# EasyEDA Pro project ProPrj_Hitboard PCB Lite v1.6 typec 左上_2026-01-22.epro

# Board PCB1
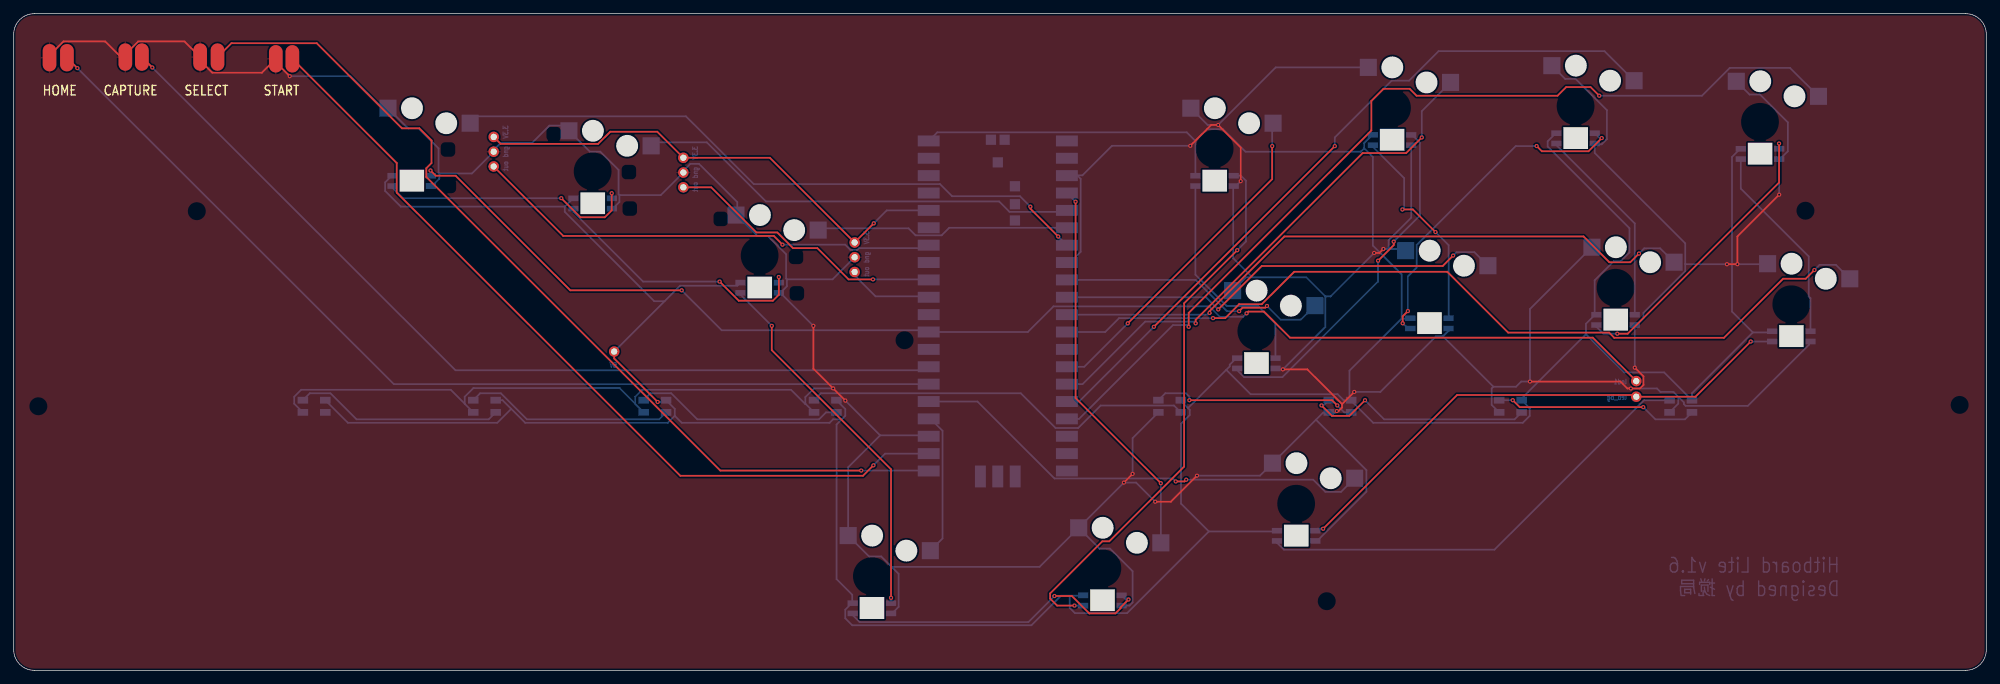
[diagram p0: board, top side]
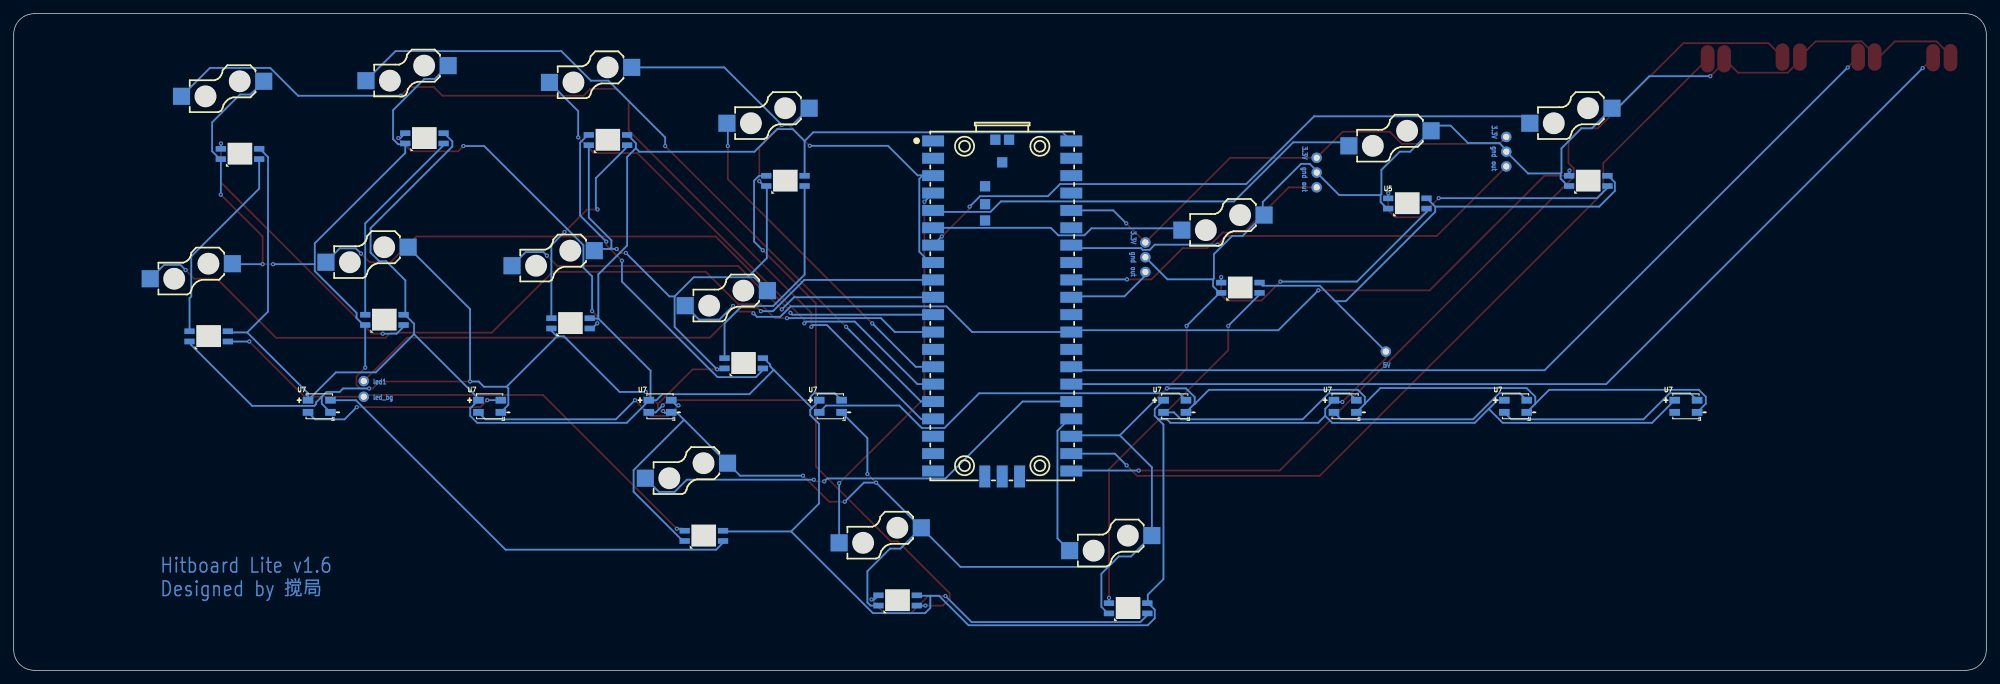
[diagram p1: board, bottom side, seen from below]

Outline 288 x 96 mm; copper layers: Top Layer, Bottom Layer. Coordinates in mm from the lower left corner of the outline.
Outline path: 0,93 arc(0.88,95.12) 3,96 285,96 arc(287.12,95.12) 288,93 288,3 arc(287.12,0.88) 285,0 3,0 arc(0.88,0.88) 0,3 0,93
Stack: Top Layer 0.035mm / Dielectric1 1.51mm FR4 er 4.5 / Bottom Layer 0.035mm

## Design rules (mm)
template: JLCPCB Capability(Two Layers Board)
spacing copperThickness1oz (default): track to track 0.102, other pairs 0.152 to 0.3
spacing copperThickness2oz: track to track 0.203, other pairs 0.152 to 0.3
track width copperThickness1oz (default): min 0.127, default 0.254, max 2.54
track width copperThickness2oz: min 0.203, default 0.254, max 2.54
differential pair differentialPair (default): width min 0.127, default 0.254, max 2.54; gap min 0.152, default 0.152
via viaSize (default): diameter min 0.5, default 0.61, max 10; hole min 0.3, default 0.305, max 6.3

## Placement (name value [footprint] x y rotation side)
NOREF  -  [Pad_e10670]  70.08 77.98 90 top
NOREF#2  -  [Pad_e679]  27.22 89.66 0 top
NOREF#3  -  [Pad_e682]  40.68 89.4 0 top
NOREF#4  -  [Pad_e680]  29.76 89.66 0 top
NOREF#5  -  [Pad_e10672]  70.08 73.66 90 top
NOREF#6  -  [Pad_e676]  7.77 89.56 0 top
NOREF#7  -  [Pad_e681]  38.27 89.4 0 top
NOREF#8  -  [Pad_e10657]  122.78 60.39 90 top
NOREF#9  -  [Pad_e10666]  97.77 70.62 90 top
NOREF#10  -  [Pad_e10665]  97.77 72.78 90 top
NOREF#11  -  [Pad_e434]  236.9 42.29 0 top
NOREF#12  -  [Pad_e10658]  122.78 58.23 90 top
NOREF#13  -  [Pad_e10654]  87.67 46.6 0 top
NOREF#14  -  [Pad_e678]  18.71 89.66 0 top
NOREF#15  -  [Pad_e675]  5.23 89.56 0 top
NOREF#16  -  [Pad_e5255]  236.9 40 0 top
NOREF#17  -  [Pad_e10664]  97.77 74.93 90 top
NOREF#18  -  [Pad_e677]  16.3 89.66 0 top
NOREF#19  -  [Pad_e10671]  70.08 75.82 90 top
NOREF#20  -  [Pad_e10656]  122.78 62.55 90 top
U1  PICO  [COMM-SMD_L51.0-W21.0-P2.54_SC0916]  143.68 52.95 270 bottom
U5  -  [LED-SMD_L3.2-W2.8_YO-WS2812B-3528]  187.24 19.66 180 bottom
U5#2  -  [LED-SMD_L3.2-W2.8_YO-WS2812B-3528]  58.11 71.56 180 bottom
U5#3  -  [LED-SMD_L3.2-W2.8_YO-WS2812B-3528]  84.52 68.25 180 bottom
U5#4  -  [LED-SMD_L3.2-W2.8_YO-WS2812B-3528]  108.91 55.93 180 bottom
U5#5  -  [LED-SMD_L3.2-W2.8_YO-WS2812B-3528]  125.29 9.07 180 bottom
U5#6  -  [LED-SMD_L3.2-W2.8_YO-WS2812B-3528]  158.95 10.21 180 bottom
U5#7  -  [LED-SMD_L3.2-W2.8_YO-WS2812B-3528]  175.33 71.56 180 bottom
U5#8  -  [LED-SMD_L3.2-W2.8_YO-WS2812B-3528]  181.43 44.89 180 bottom
U5#9  -  [LED-SMD_L3.2-W2.8_YO-WS2812B-3528]  201.24 77.52 180 bottom
U5#10  -  [LED-SMD_L3.2-W2.8_YO-WS2812B-3528]  206.7 50.73 180 bottom
U5#11  -  [LED-SMD_L3.2-W2.8_YO-WS2812B-3528]  228.03 77.78 180 bottom
U5#12  -  [LED-SMD_L3.2-W2.8_YO-WS2812B-3528]  233.88 51.24 180 bottom
U5#13  -  [LED-SMD_L3.2-W2.8_YO-WS2812B-3528]  254.96 75.49 180 bottom
U5#14  -  [LED-SMD_L3.2-W2.8_YO-WS2812B-3528]  259.53 48.82 180 bottom
U6  -  [CONN-SMD_HOTPLUGPAKAGE__C9900010116-1]  189.78 29.18 180 bottom
U6#2  -  [CONN-SMD_HOTPLUGPAKAGE__C9900010116-1]  60.65 81.08 180 bottom
U6#3  -  [CONN-SMD_HOTPLUGPAKAGE__C9900010116-1]  87.06 77.78 180 bottom
U6#4  -  [CONN-SMD_HOTPLUGPAKAGE__C9900010116-1]  111.45 65.46 180 bottom
U6#5  -  [CONN-SMD_HOTPLUGPAKAGE__C9900010116-1]  127.83 18.6 180 bottom
U6#6  -  [CONN-SMD_HOTPLUGPAKAGE__C9900010116-1]  161.49 19.74 180 bottom
U6#7  -  [CONN-SMD_HOTPLUGPAKAGE__C9900010116-1]  177.87 81.08 180 bottom
U6#8  -  [CONN-SMD_HOTPLUGPAKAGE__C9900010116-1]  183.97 54.41 180 bottom
U6#9  -  [CONN-SMD_HOTPLUGPAKAGE__C9900010116-1]  203.78 87.05 180 bottom
U6#10  -  [CONN-SMD_HOTPLUGPAKAGE__C9900010116-1]  209.24 60.25 180 bottom
U6#11  -  [CONN-SMD_HOTPLUGPAKAGE__C9900010116-1]  230.57 87.3 180 bottom
U6#12  -  [CONN-SMD_HOTPLUGPAKAGE__C9900010116-1]  236.42 60.76 180 bottom
U6#13  -  [CONN-SMD_HOTPLUGPAKAGE__C9900010116-1]  257.5 85.02 180 bottom
U6#14  -  [CONN-SMD_HOTPLUGPAKAGE__C9900010116-1]  262.07 58.35 180 bottom
U7  -  [LED-SMD_4P-L3.5-W3.5-TL_WS2812B]  243.39 38.6 180 bottom
U7#2  -  [LED-SMD_4P-L3.5-W3.5-TL_WS2812B]  218.51 38.6 180 bottom
U7#3  -  [LED-SMD_4P-L3.5-W3.5-TL_WS2812B]  193.64 38.6 180 bottom
U7#4  -  [LED-SMD_4P-L3.5-W3.5-TL_WS2812B]  168.76 38.6 180 bottom
U7#5  -  [LED-SMD_4P-L3.5-W3.5-TL_WS2812B]  118.48 38.6 180 bottom
U7#6  -  [LED-SMD_4P-L3.5-W3.5-TL_WS2812B]  93.61 38.6 180 bottom
U7#7  -  [LED-SMD_4P-L3.5-W3.5-TL_WS2812B]  68.73 38.6 180 bottom
U7#8  -  [LED-SMD_4P-L3.5-W3.5-TL_WS2812B]  43.86 38.6 180 bottom

## Footprints (pads in the part's own frame, mm; a bottom-side part is the same pattern mirrored in y, then rotated)
COMM-SMD_L51.0-W21.0-P2.54_SC0916
  rect 1.6x3.2 smd: 1(-24.445,-10.088) 2(-21.905,-10.088) 3(-19.365,-10.088) 4(-16.825,-10.088) 5(-14.285,-10.088) 6(-11.745,-10.088) 7(-9.205,-10.088) 8(-6.665,-10.088) 9(-4.125,-10.088) 10(-1.585,-10.088) 11(0.955,-10.088) 12(3.495,-10.088) 13(6.035,-10.088) 14(8.575,-10.088) 15(11.115,-10.088) 16(13.655,-10.088) 17(16.195,-10.088) 18(18.735,-10.088) 19(21.275,-10.088) 20(23.815,-10.088) 21(23.815,10.088) 22(21.275,10.088) 23(18.735,10.088) 24(16.195,10.088) 25(13.655,10.088) 26(11.115,10.088) 27(8.575,10.088) 28(6.035,10.088) 29(3.495,10.088) 30(0.955,10.088) 31(-1.585,10.088) 32(-4.125,10.088) 33(-6.665,10.088) 34(-9.205,10.088) 35(-11.745,10.088) 36(-14.285,10.088) 37(-16.825,10.088) 38(-19.365,10.088) 39(-21.905,10.088) 40(-24.445,10.088)
  rect 3.2x1.6 smd: 41(24.615,-2.54) 42(24.615,0) 43(24.615,2.54)
  rect 1.5x1.5 smd: TP1(-21.315,0) TP2(-24.615,1) TP3(-24.615,-1) TP4(-17.815,-2.5) TP5(-15.188,-2.5) TP6(-12.815,-2.5)
CONN-SMD_HOTPLUGPAKAGE__C9900010116-1
  rect 2.5x2.5 smd: 1(-6,-1.1) 2(6,1.1)
LED-SMD_4P-L3.5-W3.5-TL_WS2812B
  rect 1.545x0.997 smd: 1(-1.637,0.89) 2(-1.637,-0.89) 3(1.637,-0.89) 4(1.637,0.89)
LED-SMD_L3.2-W2.8_YO-WS2812B-3528
  rect 1.5x0.82 smd: 1(2.8,0.75) 2(2.8,-0.75) 3(-2.8,-0.75) 4(-2.8,0.75)
Pad_e434
  round 1.524 hole 0.914: 1(0,0)
Pad_e675
  oval 2x4 smd: 1(0,0)
Pad_e676
  oval 2x4 smd: 1(0,0)
Pad_e677
  oval 2x4 smd: 1(0,0)
Pad_e678
  oval 2x4 smd: 1(0,0)
Pad_e679
  oval 2x4 smd: 1(0,0)
Pad_e680
  oval 2x4 smd: 1(0,0)
Pad_e681
  oval 2x4 smd: 1(0,0)
Pad_e682
  oval 2x4 smd: 1(0,0)
Pad_e5255
  round 1.524 hole 0.914: 1(0,0)
Pad_e10654
  round 1.524 hole 0.914: 1(0,0)
Pad_e10656
  round 1.524 hole 0.914: 1(0,0)
Pad_e10657
  round 1.524 hole 0.914: 1(0,0)
Pad_e10658
  round 1.524 hole 0.914: 1(0,0)
Pad_e10664
  round 1.524 hole 0.914: 1(0,0)
Pad_e10665
  round 1.524 hole 0.914: 1(0,0)
Pad_e10666
  round 1.524 hole 0.914: 1(0,0)
Pad_e10670
  round 1.524 hole 0.914: 1(0,0)
Pad_e10671
  round 1.524 hole 0.914: 1(0,0)
Pad_e10672
  round 1.524 hole 0.914: 1(0,0)

## Nets
3V3: NOREF.1 NOREF#17.1 NOREF#20.1 U1.36
GND: NOREF#2.1 NOREF#7.1 NOREF#8.1 NOREF#10.1 NOREF#15.1 NOREF#18.1 NOREF#19.1 U1.3 U1.8 U1.23 U5.3 U5#2.3 U5#3.3 U5#4.3 U5#5.3 U5#6.3 U5#7.3 U5#8.3 U5#9.3 U5#10.3 U5#11.3 U5#12.3 U5#13.3 U5#14.3 U6.2 U6#2.2 U6#3.2 U6#4.2 U6#5.2 U6#6.2 U6#7.2 U6#8.2 U6#9.2 U6#10.2 U6#11.2 U6#12.2 U6#13.2 U6#14.2 U7.3 U7#2.3 U7#3.3 U7#4.3 U7#5.3 U7#6.3 U7#7.3 U7#8.3
VCC: NOREF#13.1 U1.40 U5.1 U5#2.1 U5#3.1 U5#4.1 U5#5.1 U5#6.1 U5#7.1 U5#8.1 U5#9.1 U5#10.1 U5#11.1 U5#12.1 U5#13.1 U5#14.1 U7.1 U7#2.1 U7#3.1 U7#4.1 U7#5.1 U7#6.1 U7#7.1 U7#8.1
2: U5#2.2 U5#3.4
3: U5#3.2 U5#4.4
4: U5#4.2 U5#5.4
5: U5#5.2 U5#6.4
6: U5#6.2 U5#7.4
7: U5#7.2 U5#8.4
8: U5#8.2 U5#9.4
9: U5#9.2 U5#10.4
10: U5#10.2 U5#11.4
11: U5#11.2 U5#12.4
12: U5#12.2 U5#13.4
13: U5#13.2 U5#14.4
14: NOREF#16.1 U5.4 U5#14.2
15: U5.2 U7.4
16: U7.2 U7#2.4
17: U7#2.2 U7#3.4
18: U7#3.2 U7#4.4
19: U7#4.2 U7#5.4
20: U7#5.2 U7#6.4
21: U7#6.2 U7#7.4
22: U7#7.2 U7#8.4
23: U7#8.2
A: U1.9 U6#8.1
B: U1.10 U6#10.1
CAPTURE: NOREF#14.1 U1.27
CIZHOU01: NOREF#5.1 U1.34
CIZHOU02: NOREF#9.1 U1.32
CIZHOU03: NOREF#12.1 U1.31
DOWN: U1.5 U6#3.1
HOME: NOREF#6.1 U1.26
L3: U1.24 U6#5.1
LB: U1.17 U6#13.1
LED1: NOREF#11.1 U1.29 U5#2.4
LEFT: U1.7 U6#2.1
LT: U1.12 U6#14.1
R3: U1.25 U6.1
RB: U1.16 U6#11.1
RIGHT: U1.6 U6#4.1
RT: U1.11 U6#12.1
SELECT: NOREF#4.1 U1.21
START: NOREF#3.1 U1.22
UP: U1.4 U6#6.1
X: U1.14 U6#7.1
Y: U1.15 U6#9.1

Pads without a net: U1 1 2 13 18 19 20 28 30 33 35 37 38 39 41 42 43 TP1 TP2 TP3 TP4 TP5 TP6

## Via types
v1: diameter 0.61, hole 0.305, Top Layer to Bottom Layer, 83 vias

## Routing (per net, layer and track width the routed paths; a pad name or vN(x,y) marks a point on that pad's centre or on a via; arc(x,y) is an arc through that point)
3V3: length 73.3
  Top Layer w0.254: v1(125.57,65.35) NOREF#20.1 110.39,74.93 NOREF#17.1 93.96,78.74 87.1,78.74 85.32,76.97 71.1,76.97 NOREF.1
  Bottom Layer w0.254: U1.36 127.46,67.24 v1(125.57,65.35)
GND: length 846.9
  Top Layer w0.254: v1(121.42,39.44) v1(119.64,41.21) 116.75,44.1 v1(116.75,50.36) ; v1(166.66,24.65) 168.95,24.65 v1(172.76,28.46) ; v1(179.15,71.51) 179.15,76.43 v1(175.84,79.73) 174.83,79.73 v1(171.78,76.68) ; 193.94,38.92 188.86,44 v1(185.3,44) ; 193.94,38.92 193.94,38.41 193.43,37.9 v1(193.18,37.9) ; 193.94,38.92 v1(195.72,40.7) ; NOREF#15.1 5.23,89.91 7.26,91.94 13.36,91.94 15.64,89.66 16.15,89.66 ; 16.15,89.66 NOREF#18.1 ; 16.15,89.66 16.15,89.91 18.19,91.94 24.93,91.94 NOREF#2.1 27.22,89.15 29,87.37 36.24,87.37 NOREF#7.1 38.27,88.89 v1(40.3,86.86) ; v1(250.14,59.38) v1(251.66,59.38) 251.66,63.44 v1(257.76,69.54) ; v1(221.37,42.22) 234.58,42.22 235.6,41.21 v1(236.1,41.21) 237.44,41.21 237.95,41.71 237.95,42.98 v1(236.68,44.25) ; v1(199.97,61.61) 199.38,61.02 v1(198.62,61.02) ; v1(162.09,27.44) v1(163.36,28.71)
  Bottom Layer w0.254: 178.13,70.75 178.05,70.67 178.05,60.26 180.84,57.46 ; 178.13,70.75 178.38,70.75 v1(179.15,71.51) ; 178.13,70.75 U5#7.3 ; 116.85,37.71 115.63,38.93 115.58,38.93 ; v1(198.62,61.02) 192.27,54.67 191.51,54.67 ; 65.85,38.98 65.85,40 67.12,41.27 88.45,41.27 90.74,38.98 ; 65.85,38.98 65.85,38.96 U7#7.3 ; 65.85,38.98 63.82,41.01 41.97,41.01 40.96,40 40.96,38.98 U7#8.3 ; 190.13,36.63 191.15,37.65 191.91,37.65 ; 190.13,36.63 197.5,29.27 197.5,26.11 190.29,18.91 U5.3 ; 190.13,36.63 181.96,28.46 v1(172.76,28.46) ; 54.52,82.29 U6#2.2 ; 54.52,82.29 53.76,82.29 49.19,86.86 v1(40.3,86.86) ; 54.52,82.29 57.57,79.24 59.1,79.24 62.03,76.31 62.03,72.76 62.14,72.64 ; v1(171.78,76.68) 160.35,76.68 156.03,72.36 155.27,72.36 ; 111.93,55.18 U5#4.3 ; 111.93,55.18 v1(116.75,50.36) ; 111.93,55.18 112.89,56.15 112.89,57.16 ; 115.58,38.93 115.58,39.94 116.85,41.21 v1(119.64,41.21) ; 115.58,38.93 113.49,41.01 91.76,41.01 90.74,40 90.74,38.98 ; U1.23 133.45,34.36 126.5,34.36 ; U6#6.2 158.53,17.79 160.06,17.79 163.36,14.49 163.36,9.92 162.91,9.46 U5#6.3 ; U6#6.2 149.77,15.12 128.18,15.12 ; U6#6.2 v1(162.09,27.44) 163.87,27.44 v1(166.66,24.65) ; 208.67,48.83 207.66,48.83 199.53,40.7 v1(195.72,40.7) ; 208.67,48.83 209.5,49.65 U5#10.3 ; 208.67,48.83 216.04,41.46 ; 88.43,69.48 88.31,69.6 88.31,73.15 85.64,75.83 84.11,75.83 U6#3.2 80.31,79.63 78.21,79.63 75.67,77.09 71.1,77.09 70.08,76.08 NOREF#19.1 66.9,72.64 62.14,72.64 ; 88.43,69.48 88.43,68.46 87.47,67.5 U5#3.3 ; 88.43,69.48 94.47,69.48 NOREF#10.1 97.77,73.03 98.78,74.05 100.05,74.05 105.64,68.46 105.64,66.68 105.52,66.56 ; 191.51,54.67 188.71,57.46 180.84,57.46 ; 191.51,54.67 191.51,50.2 v1(185.3,44) 184.36,44 U5#8.3 ; U6#12.2 221.37,52.82 v1(221.37,42.22) 220.1,42.22 219.34,41.46 216.04,41.46 ; 191.91,37.65 U7#3.3 ; 191.91,37.65 192.92,37.65 v1(193.18,37.9) ; v1(199.97,61.61) 200.99,61.61 ; 200.99,61.61 202.98,61.61 U6#10.2 ; 200.99,61.61 200.73,61.86 200.73,62.88 204.04,66.18 U5#9.3 ; 180.84,57.46 179.92,57.46 U6#8.2 ; 62.14,72.64 62.14,71.88 61.25,70.98 61.08,70.98 U5#2.3 ; 244.04,59.38 244.04,62.42 230.83,75.63 230.83,76.9 ; 244.04,59.38 v1(250.14,59.38) ; 244.04,59.38 244.04,58.36 237.95,52.26 237.95,51.5 236.93,50.49 U5#12.3 v1(236.68,44.25) ; 112.89,57.16 112.77,57.28 112.77,60.84 110.09,63.51 108.57,63.51 105.52,66.56 ; 112.89,57.16 119.55,57.16 NOREF#8.1 ; 155.27,72.36 153.81,72.36 U1.3 ; 155.27,72.36 155.78,71.86 155.78,61.19 154.21,59.62 U1.8 ; v1(251.66,59.38) 256,59.38 256.07,59.45 ; 251.5,86.12 253.44,84.18 254.96,84.18 259.03,80.11 259.03,75.89 257.76,74.62 ; 257.76,74.62 U5#13.3 ; 257.76,74.62 v1(257.76,69.54) ; 243.02,40 243.85,39.17 243.85,38.92 244.1,38.67 253.18,38.67 262.13,47.62 262.13,47.88 U5#14.3 ; 243.02,40 242.32,40.7 240.42,40.7 239.91,41.21 v1(236.1,41.21) ; 243.02,40 243.02,38.98 U7.3 ; 126.5,34.36 121.83,29.69 U6#5.2 124.88,16.65 126.66,16.65 128.18,15.12 ; 126.5,34.36 v1(121.42,39.44) ; 216.04,41.46 215.78,41.21 215.78,38.8 U7#2.3 ; 128.18,15.12 129.2,14.11 129.2,9.28 128.24,8.32 U5#5.3 ; U6#11.2 226.52,86.46 228.04,86.46 232.61,81.89 232.61,77.66 231.85,76.9 230.83,76.9 ; U6#9.2 184.26,88.15 v1(175.84,79.73) 174.32,79.73 U6#7.2 ; 105.52,66.56 U6#4.2 ; v1(163.36,28.71) 163.36,33.95 U7#4.3 ; 90.74,38.98 90.74,38.94 U7#6.3 ; 230.83,76.9 U5#11.3
VCC: length 598.1
  Top Layer w0.254: NOREF#13.1 87.67,45.59 v1(94.02,39.24)
  Bottom Layer w0.254: 174.49,20.3 170.43,24.37 170.43,36.05 171.7,37.32 171.7,38.08 171.45,38.34 ; 174.49,20.3 184.33,20.3 184.44,20.41 ; 174.49,20.3 162.56,8.36 154.94,8.36 154.17,9.13 154.17,10.9 ; U7#5.1 121.41,38.21 121.41,37.21 120.9,36.7 ; 230.82,51.94 U5#12.1 ; 230.82,51.94 230.82,57.02 233.61,59.81 234.63,59.81 235.9,61.08 235.9,64.64 223.96,76.58 223.96,77.34 225.15,78.53 U5#11.1 ; 230.82,51.94 229.55,50.67 229.55,49.14 ; 80.45,67.79 56.52,67.79 54.23,70.08 54.23,71.35 55.19,72.31 U5#2.1 ; 80.45,67.79 81.67,69 U5#3.1 ; 80.45,67.79 80.45,67.03 93.51,53.97 95.04,53.97 ; 172.53,77.39 U5#7.1 ; 172.53,77.39 171.26,78.66 134.85,78.66 U1.40 ; 172.53,77.39 174.26,79.12 176.55,79.12 179.85,75.81 196.66,75.81 197.17,76.32 ; NOREF#13.1 95.04,53.97 ; 95.04,53.97 97.3,56.23 105.65,56.23 U5#4.1 ; 72.64,38.22 74.67,36.19 95.5,36.19 96.52,37.21 ; 72.64,38.22 71.37,39.49 U7#7.1 ; 72.64,38.22 70.61,36.19 48.8,36.19 U7#8.1 ; 154.17,10.9 152.9,10.9 148.59,6.59 122.42,6.59 121.41,7.6 121.41,8.87 122.42,9.89 ; 154.17,10.9 156.09,10.9 U5#6.1 ; 96.52,37.21 96.52,38.22 U7#6.1 94.99,39.24 v1(94.02,39.24) ; 96.52,37.21 97.53,36.19 119.12,36.19 119.63,36.7 120.9,36.7 ; 195.18,39.49 194.17,39.49 193.29,40.37 180.59,40.37 177.03,43.92 ; 195.18,39.49 198.48,36.19 220.33,36.19 221.34,37.21 221.34,38.3 U7#2.1 220.15,39.75 229.55,49.14 ; 195.18,39.49 U7#3.1 195.02,39.75 195.02,43.81 202.64,51.43 ; 253.92,49.4 245.03,40.51 U7.1 240.96,43.56 235.14,43.56 229.55,49.14 ; 253.92,49.4 250.87,52.45 250.87,75.05 252.06,76.24 U5#13.1 ; 253.92,49.4 256.56,49.4 U5#14.1 ; U5#8.1 178.49,45.64 177.54,44.69 177.54,44.43 177.03,43.92 ; 120.9,36.7 120.14,35.94 120.14,13.33 122.42,11.04 122.42,9.89 ; 122.42,9.89 U5#5.1 ; 202.64,51.43 203.85,51.43 U5#10.1 ; 202.64,51.43 202.64,57.89 198.44,62.1 198.44,75.05 197.17,76.32 ; U7#4.1 170.4,39.38 171.45,38.34 ; 171.45,38.34 177.03,43.92 ; 197.17,76.32 197.17,77.08 198.36,78.27 U5#9.1
2: length 37.7
  Top Layer w0.254: v1(87.31,69.75) 87.31,67.25 86.3,66.23 82.74,66.23 v1(79.95,69.03)
  Bottom Layer w0.254: v1(79.95,69.03) 56.83,69.03 55.31,70.55 U5#2.2 ; v1(87.31,69.75) 87.31,69.02 U5#3.4
3: length 39.6
  Top Layer w0.254: v1(111.71,57.49) 111.71,54.91 110.84,54.04 105.85,54.04 v1(103.06,56.84)
  Bottom Layer w0.254: v1(103.06,56.84) 91.88,56.84 81.72,67 U5#3.2 ; v1(111.71,57.49) U5#4.4
4: length 54.5
  Top Layer w0.254: v1(110.68,50.36) 110.68,46.8 128.09,29.39 v1(128.09,10.6)
  Bottom Layer w0.254: v1(128.09,10.6) U5#5.4 ; U5#4.2 106.11,54.93 v1(110.68,50.36)
5: length 45.8
  Top Layer w0.254: v1(162.76,10.35) 161.61,9.2 161.61,9.08 160.84,8.32 157.03,8.32 154.5,10.86 v1(151.96,10.86)
  Bottom Layer w0.254: v1(162.76,10.35) 162.36,10.35 U5#6.4 ; U5#5.2 122.49,8.07 123.51,7.05 148.15,7.05 v1(151.96,10.86)
6: length 80.9
  Top Layer w0.254: v1(154.88,9.46) 152.34,9.46 151.32,10.48 151.32,11.24 158.94,18.86 159.96,18.86 170.88,29.78 170.88,53.66 v1(178.64,61.42)
  Bottom Layer w0.254: U5#7.4 179.18,72.31 179.91,71.58 179.91,62.69 v1(178.64,61.42) ; U5#6.2 v1(154.88,9.46)
7: length 32.7
  Bottom Layer w0.254: U5#7.2 172.53,57.84 177.1,53.27 181.67,53.27 184.21,50.73 184.21,45.65 U5#8.4
8: length 51.6
  Top Layer w0.254: v1(201.49,62.68) 201.49,62.17 v1(199.2,59.88)
  Bottom Layer w0.254: U5#8.2 178.62,43.88 179.64,42.87 185.23,42.87 199.2,56.84 v1(199.2,59.88) ; U5#9.4 204.18,78.27 205.31,77.14 205.31,66.5 v1(201.49,62.68)
9: length 31
  Top Layer w0.254: v1(207.58,64.07) 204.28,67.38 v1(202.75,67.38)
  Bottom Layer w0.254: v1(207.58,64.07) 209.5,62.16 U5#10.4 ; U5#9.2 198.44,76.52 203.01,71.95 203.01,67.63 v1(202.75,67.38)
10: length 49.1
  Top Layer w0.254: v1(222.35,76.65) 223.11,75.89 229.92,75.89 v1(231.85,77.81) ; v1(202.79,50.74) 202.79,51.76 v1(203.55,52.52)
  Bottom Layer w0.254: v1(231.85,77.81) 231.55,77.81 U5#11.4 ; v1(202.79,50.74) 203.55,49.98 U5#10.2 ; v1(203.55,52.52) 203.55,57.6 204.82,58.87 204.82,62.17 219.3,76.65 v1(222.35,76.65)
11: length 29.8
  Bottom Layer w0.254: U5#12.4 236.68,65.33 225.23,76.77 U5#11.2
12: length 43
  Top Layer w0.254: v1(257.75,77.02) 257.75,71.31 235.65,49.22 v1(234.12,49.22)
  Bottom Layer w0.254: U5#13.4 257.75,76.25 v1(257.75,77.02) ; U5#12.2 231.08,50.23 232.09,49.22 v1(234.12,49.22)
13: length 29.4
  Bottom Layer w0.254: U5#14.4 262.33,54.41 262.08,54.66 262.08,60.51 252.16,70.42 U5#13.2
14: length 78.4
  Top Layer w0.254: v1(191.18,20.7) 210.73,40.25 236.64,40.25 NOREF#16.1 245.53,40 v1(253.61,48.07)
  Bottom Layer w0.254: U5.4 190.33,20.7 v1(191.18,20.7) ; v1(253.61,48.07) U5#14.2
15: length 67
  Bottom Layer w0.254: 184.44,18.91 184.44,18.65 185.46,17.64 216.19,17.64 238.03,39.48 241.74,39.48 U7.4
16: length 29.7
  Top Layer w0.254: v1(218.87,39.49) 219.88,38.47 v1(237.91,38.47)
  Bottom Layer w0.254: U7.2 244.01,36.7 239.69,36.7 v1(237.91,38.47) ; v1(218.87,39.49) 216.88,39.49
17: length 33.7
  Top Layer w0.254: v1(197.29,39.49) 195,37.2 192.47,37.2 v1(190.94,38.73)
  Bottom Layer w0.254: U7#3.4 191.24,38.73 v1(190.94,38.73) ; v1(197.29,39.49) 200.09,36.7 219.13,36.7 U7#2.2
18: length 30
  Top Layer w0.254: v1(171.65,39.49) 192.48,39.49 v1(193.24,38.73)
  Bottom Layer w0.254: U7#3.2 194.26,37.71 v1(193.24,38.73) ; U7#4.4 168.14,40.51 171.14,40.51 171.65,40 v1(171.65,39.49)
19: length 57.8
  Bottom Layer w0.254: 116.85,39.49 117.86,40.51 147.03,40.51 152.11,35.43 155.41,35.43 158.7,38.71 169.4,38.71 U7#4.2
20: length 30.6
  Bottom Layer w0.254: U7#5.2 118.6,37.71 117.58,36.7 99.8,36.7 95.99,40.51 92.98,40.51 U7#6.4
21: length 30.6
  Bottom Layer w0.254: U7#7.4 68.11,40.51 71.12,40.51 74.93,36.7 94.23,36.7 U7#6.2
22: length 30.6
  Bottom Layer w0.254: U7#7.2 69.35,36.7 50.05,36.7 46.24,40.51 43.23,40.51 U7#8.4
A: length 40.1
  Top Layer w0.254: v1(182.98,53.27) 182.72,53.01 179.42,53.01 v1(178.91,52.51)
  Bottom Layer w0.254: U1.9 172.56,57.08 177.13,52.51 v1(178.91,52.51) ; v1(182.98,53.27) 184.97,51.28 187.93,51.28 U6#8.1
B: length 66.5
  Top Layer w0.254: v1(175.86,52.76) 182.21,59.11 208.63,59.11 v1(210.15,60.63)
  Bottom Layer w0.254: v1(210.15,60.63) 210.66,61.14 213.25,61.14 U6#10.1 ; v1(175.86,52.76) 174.09,54.54 U1.10
CAPTURE: length 134.1
  Top Layer w0.254: NOREF#14.1 v1(20.23,88.13)
  Bottom Layer w0.254: v1(20.23,88.13) 64.5,43.87 133.08,43.87 U1.27
CIZHOU01: length 68.8
  Top Layer w0.254: v1(112.25,62.23) 110.98,63.5 80.24,63.5 NOREF#5.1
  Bottom Layer w0.254: U1.34 133.16,61.73 123.42,61.73 123.17,61.47 122.15,61.47 121.39,62.23 v1(112.25,62.23)
CIZHOU02: length 41.4
  Top Layer w0.254: NOREF#9.1 101.83,70.62 108.44,64.01 111.48,64.01 113.77,61.73 117.33,61.73 121.9,57.15 v1(125.45,57.15)
  Bottom Layer w0.254: v1(125.45,57.15) 133.52,57.15 U1.32
CIZHOU03: length 12.6
  Bottom Layer w0.254: NOREF#12.1 122.78,57.73 125.83,54.68 133.45,54.68 U1.31
DOWN: length 65.2
  Bottom Layer w0.254: U6#3.1 93.57,77.19 101.19,77.19 109.83,68.55 143.86,68.55 145.39,67.03 153.55,67.03 U1.5
HOME: length 145.6
  Top Layer w0.254: NOREF#6.1 v1(9.3,88.04)
  Bottom Layer w0.254: U1.26 55.5,41.84 v1(9.3,88.04)
L3: length 21
  Bottom Layer w0.254: U1.24 133.87,36.76 135.61,35.02 135.61,19.27 U6#5.1
LB: length 138.5
  Top Layer w0.254: v1(231.49,84) 230.22,85.27 226.66,85.27 225.39,84 204.82,84 203.8,85.02 199.99,85.02 198.22,83.24 198.22,78.92 171.55,52.25 v1(171.55,50.22)
  Bottom Layer w0.254: v1(231.49,84) 246.48,84 250.54,88.07 259.35,88.07 U6#13.1 ; U1.17 155.54,36.76 169.26,50.47 171.29,50.47 v1(171.55,50.22)
LED1: length 193.3
  Top Layer w0.254: v1(97.52,55.55) 81.27,55.55 64.52,72.31 61.62,72.31 v1(60.86,73.07) ; NOREF#11.1 230.55,48.64 186.35,48.64 182.54,52.45 180.25,52.45 v1(180,52.19)
  Bottom Layer w0.254: U5#2.4 60.86,72.36 v1(60.86,73.07) ; v1(97.52,55.55) 103.37,49.71 133.34,49.71 U1.29 148.06,49.46 151.81,53.21 174.56,53.21 176.08,51.68 179.49,51.68 v1(180,52.19)
LEFT: length 95.5
  Top Layer w0.254: v1(152.5,63.42) 148.44,67.49 v1(148.44,67.79)
  Bottom Layer w0.254: v1(152.5,63.42) U1.7 ; v1(148.44,67.79) 146.91,69.31 137.01,69.31 135.23,71.09 108.05,71.09 98.14,81 67.66,81 U6#2.1
LT: length 127.2
  Top Layer w0.254: v1(262.9,58.52) 261.63,57.25 258.33,57.25 249.69,48.61 233.69,48.61 232.93,49.37 218.2,49.37 209.31,58.26 186.95,58.26 182.21,53.52 178.91,53.52 176.88,51.49 v1(175.1,51.49)
  Bottom Layer w0.254: v1(262.9,58.52) 263.66,59.28 266.04,59.28 U6#14.1 ; v1(175.1,51.49) 161.39,51.49 159.35,49.46 U1.12
R3: length 68.7
  Top Layer w0.254: v1(169.66,27.61) 170.93,27.61 v1(171.18,27.87)
  Bottom Layer w0.254: v1(171.18,27.87) 189.72,27.87 191.5,26.09 193.79,26.09 U6.1 ; U1.25 140.7,39.3 151.96,28.05 169.23,28.05 v1(169.66,27.61)
RB: length 106.6
  Top Layer w0.254: v1(166.47,50.22) v1(192.88,76.64)
  Bottom Layer w0.254: v1(166.47,50.22) 155.54,39.3 U1.16 ; v1(192.88,76.64) 192.88,77.91 201.18,86.2 203.72,86.2 208.04,90.52 232.26,90.52 U6#11.1
RIGHT: length 37.3
  Bottom Layer w0.254: U6#4.1 117.7,64.61 130.66,64.61 131.67,63.6 135.48,63.6 136.58,64.7 U1.6
RT: length 96.8
  Top Layer w0.254: v1(174.59,52.25) 174.59,52.51 185.52,63.43 229.2,63.43 232.97,59.66 236.02,59.66 v1(237.29,60.93)
  Bottom Layer w0.254: v1(237.29,60.93) 238.05,61.69 240.38,61.69 U6#12.1 ; v1(174.59,52.25) 174.34,52 U1.11
SELECT: length 134.8
  Top Layer w0.254: v1(123.74,29.2) 103.17,29.2 60.24,72.13 60.24,73.4 61,74.16 61,77.46 59.22,79.24 56.68,79.24 44.24,91.69 31.79,91.69 NOREF#4.1
  Bottom Layer w0.254: U1.21 133.53,29.2 v1(123.74,29.2)
START: length 122
  Top Layer w0.254: NOREF#3.1 55.92,74.16 55.92,69.84 97.32,28.44 123.99,28.44 v1(125.52,29.97)
  Bottom Layer w0.254: U1.22 127.23,31.68 v1(125.52,29.97)
UP: length 56.8
  Top Layer w0.254: v1(155.04,68.51) 155.04,39.81 v1(167.48,27.36)
  Bottom Layer w0.254: v1(167.48,27.36) 167.48,18.64 ; U1.4 v1(155.04,68.51)
X: length 49.6
  Top Layer w0.254: v1(183.74,76.64) 183.74,71.81 v1(162.66,50.73)
  Bottom Layer w0.254: U1.14 156.31,44.38 v1(162.66,50.73) ; v1(183.74,76.64) 183.74,79.85 U6#7.1
Y: length 77
  Top Layer w0.254: v1(205.58,77.91) 203.3,75.62 196.95,75.62 172.56,51.24 v1(172.56,50.73)
  Bottom Layer w0.254: U1.15 156.05,41.84 165.2,50.98 172.31,50.98 v1(172.56,50.73) ; U6#9.1 205.58,81.75 v1(205.58,77.91)

## Copper pours and planes (outline as drawn; the poured copper is in the pictures)
GND on Top Layer: -5.93,102.1 300.52,102.1 300.52,-9.4 -5.93,-9.4

## Text on the board
Bottom Layer: 5V | led1 | led_bg | out | 3.3V | gnd | Hitboard Lite v1.6 / Designed by 搅局
Top Silkscreen Layer: HOME | CAPTURE | SELECT | START
